# EAGLE design LCD and Keypad Arduino Uno Shield_V2 (EAGLE 9.6.2)
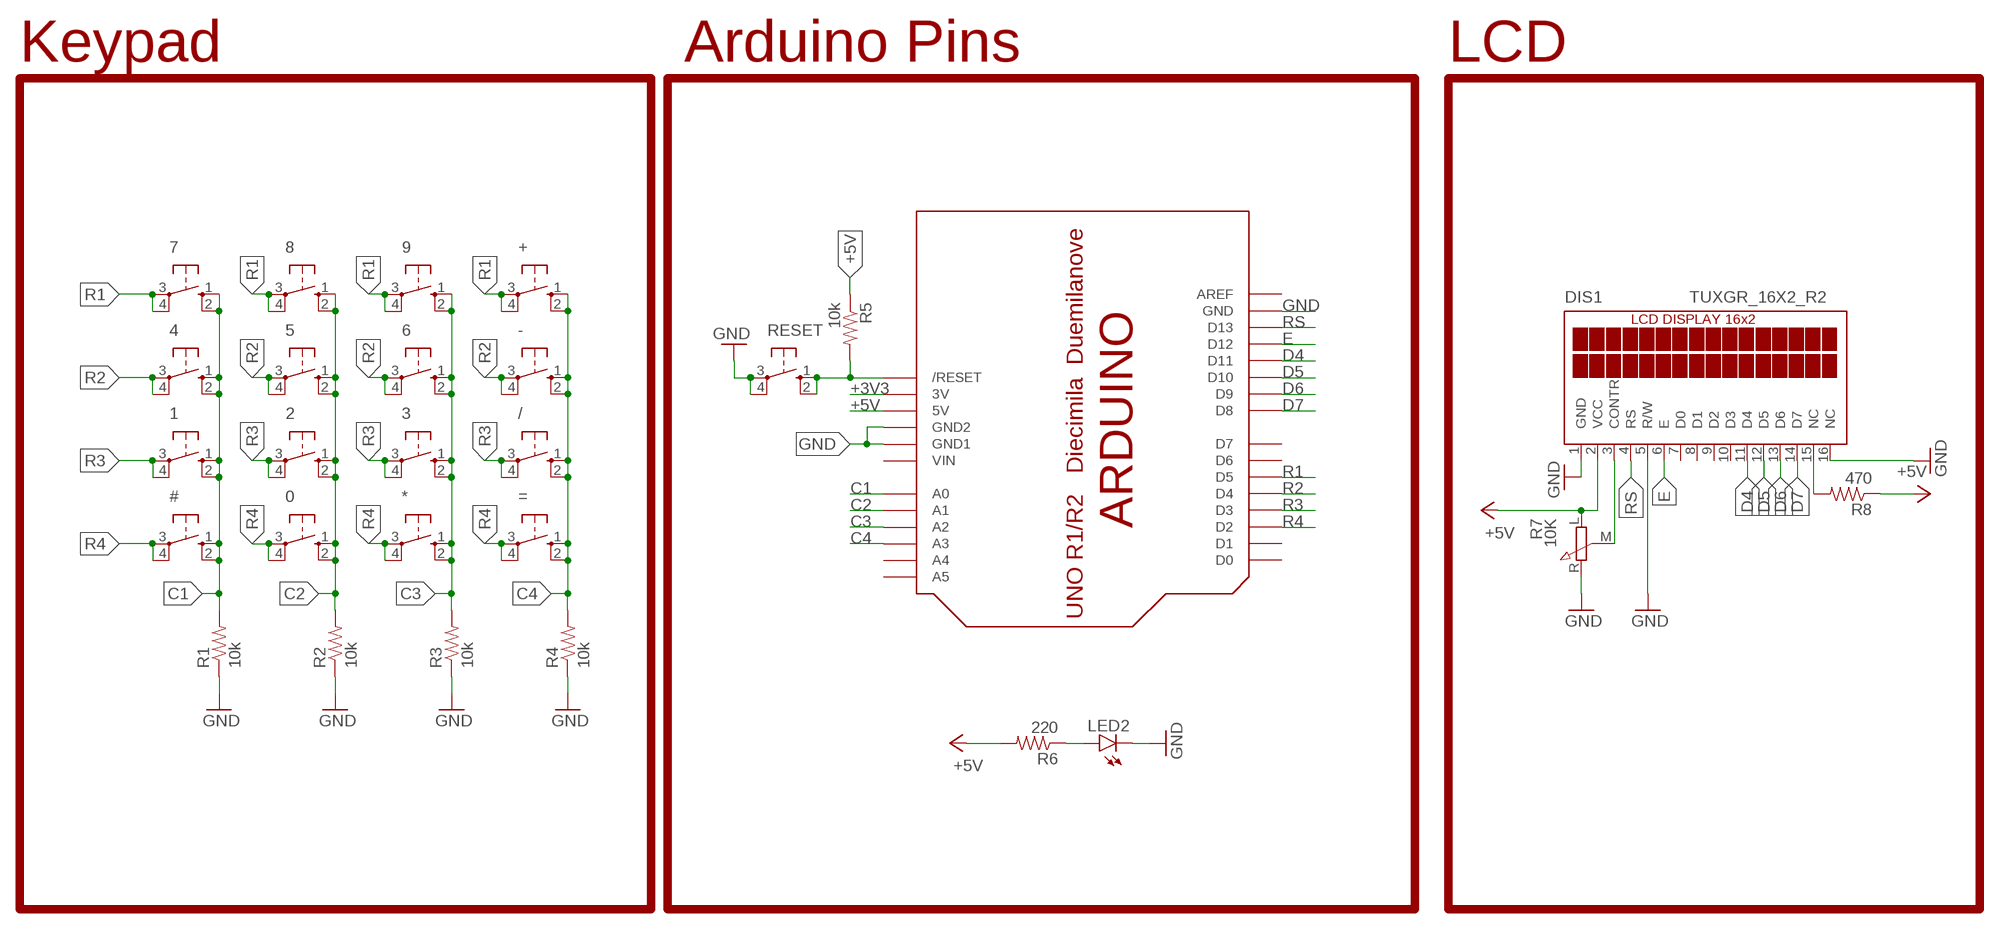
[diagram p0: schematic, sheet 1]

## Parts
0  10-XX  [B3F-10XX]
1  10-XX  [B3F-10XX]
2  10-XX  [B3F-10XX]
3  10-XX  [B3F-10XX]
4  10-XX  [B3F-10XX]
5  10-XX  [B3F-10XX]
6  10-XX  [B3F-10XX]
7  10-XX  [B3F-10XX]
8  10-XX  [B3F-10XX]
9  10-XX  [B3F-10XX]
#  10-XX  [B3F-10XX]
*  10-XX  [B3F-10XX]
+  10-XX  [B3F-10XX]
-  10-XX  [B3F-10XX]
/  10-XX  [B3F-10XX]
=  10-XX  [B3F-10XX]
DIS1  TUXGR_16X2_R2  [TUXGR_16X2_R2]
LED2  LEDSML0805  [SML0805]
R1  10k  RESISTOR1206  [1206]
R2  10k  RESISTOR1206  [1206]
R3  10k  RESISTOR1206  [1206]
R4  10k  RESISTOR1206  [1206]
R5  10k  RESISTOR1206  [1206]
R6  220  RESISTOR1206  [1206]
R7  10K  POT-EU  [RM-065]
R8  470  RESISTOR1206  [1206]
RESET  10-XX  [B3F-10XX]
U$1  ARDUINO-NODIM  [ARDUINO-NODIM]

## Nets
+3V3: U$1.3V
+5V: DIS1.2(VCC) R5.1 R6.2 R7.L R8.1 U$1.5V
C1: 1.1(S) 1.2(S1) 4.1(S) 4.2(S1) 7.1(S) 7.2(S1) #.1(S) #.2(S1) R1.2 U$1.A0
C2: 0.1(S) 0.2(S1) 2.1(S) 2.2(S1) 5.1(S) 5.2(S1) 8.1(S) 8.2(S1) R2.2 U$1.A1
C3: 3.1(S) 3.2(S1) 6.1(S) 6.2(S1) 9.1(S) 9.2(S1) *.1(S) *.2(S1) R3.2 U$1.A2
C4: +.1(S) +.2(S1) -.1(S) -.2(S1) /.1(S) /.2(S1) =.1(S) =.2(S1) R4.2 U$1.A3
D4: DIS1.11(D4) U$1.D11
D5: DIS1.12(D5) U$1.D10
D6: DIS1.13(D6) U$1.D9
D7: DIS1.14(D7) U$1.D8
E: DIS1.6(E) U$1.D12
GND: DIS1.1(GND) DIS1.5(R/W) DIS1.16(NC) LED2.C R1.1 R2.1 R3.1 R4.1 R7.R RESET.3(P) RESET.4(P1) U$1.GND U$1.GND1 U$1.GND2
N$3: DIS1.3(CONTR) R7.M
N$7: DIS1.15(NC) R8.2
N$11: LED2.A R6.1
R1: 7.3(P) 7.4(P1) 8.3(P) 8.4(P1) 9.3(P) 9.4(P1) +.3(P) +.4(P1) U$1.D5
R2: 4.3(P) 4.4(P1) 5.3(P) 5.4(P1) 6.3(P) 6.4(P1) -.3(P) -.4(P1) U$1.D4
R3: 1.3(P) 1.4(P1) 2.3(P) 2.4(P1) 3.3(P) 3.4(P1) /.3(P) /.4(P1) U$1.D3
R4: 0.3(P) 0.4(P1) #.3(P) #.4(P1) *.3(P) *.4(P1) =.3(P) =.4(P1) U$1.D2
RESET: R5.2 RESET.1(S) RESET.2(S1) U$1.RESET(/RESET)
RS: DIS1.4(RS) U$1.D13
Unconnected: DIS1.7(D0) DIS1.8(D1) DIS1.9(D2) DIS1.10(D3) U$1.A4 U$1.A5 U$1.AREF U$1.D0 U$1.D1 U$1.D6 U$1.D7

## Notes on the sheet
- Keypad | Arduino Pins | LCD

## Power pins joined to a net without a drawn wire
VIN: U$1.VIN

## Library data of the parts
0 1-9 # * + - / = RESET = switch-omron:10-XX: OMRON SWITCH; MPN: B3F-1000; OC_FARNELL: 176432; OC_NEWARK: 36M3542
DIS1 = display-lcd:TUXGR_16X2_R2: Tuxgraphics LCD display 16x2 characters reflective, without background light Source: tuxgr_12x2_r2.pdf; OC_FARNELL: unknown; OC_NEWARK: unknown
LED2 = led:LED: LED OSRAM: - CHIPLED LG R971, LG N971, LY N971, LG Q971, LY Q971, LO R971, LY R971 LH N974, LH R974 LS Q976, LO Q976, LY Q976 LO Q996 - Hyper CHIPLED LW Q18S LB Q993, LB Q99A, LB R99A - SideLED LS A670, LO A670, LY A670, LG A670, LP A670 LB A673, LV A673, LT A673, LW A673 LH A674 LY A675 LS A676, LA A676, LO A676, LY A676, LW A676 LS A679, LY A679, LG A679 - Hyper Micro SIDELED® LS Y876, LA Y876, LO Y876, LY Y876 LT Y87S - SmartLED LW L88C, LW L88S LB L89C, LB L89S, LG L890 LS L89K, LO L89K, LY L89K LS L896, LA L896, LO L896, LY L896 - TOPLED LS T670, LO T670, LY T670, LG T670, LP T670 LSG T670, LSP T670, LSY T670, LOP T670, LYG T670 LG T671, LOG T671, LSG T671 LB T673, LV T673, LT T673, LW T673 LH T674 LS T676, LA T676, LO T676, LY T676, LB T676, LH T676, LSB T676, LW T676 LB T67C, LV T67C, LT T67C, LS T67K, LO T67K, LY T67K, LW E67C LS E67B, LA E67B, LO E67B, LY E67B, LB E67C, LV E67C, LT E67C LW T67C LS T679, LY T679, LG T679 LS T770, LO T770, LY T770, LG T770, LP T770 LB T773, LV T773, LT T773, LW T773 LH T774 LS E675, LA E675, LY E675, LS T675 LS T776, LA T776, LO T776, LY T776, LB T776 LHGB T686 LT T68C, LB T68C - Hyper Mini TOPLED® LB M676 - Mini TOPLED Santana® LG M470 LS M47K, LO M47K, LY M47K Source: http://www.osram.convergy.de LUXEON: - LUMILED® LXK2-PW12-R00, LXK2-PW12-S00, LXK2-PW14-U00, LXK2-PW14-V00 LXK2-PM12-R00, LXK2-PM12-S00, LXK2-PM14-U00 LXK2-PE12-Q00, LXK2-PE12-R00, LXK2-PE12-S00, LXK2-PE14-T00, LXK2-PE14-U00 LXK2-PB12-K00, LXK2-PB12-L00, LXK2-PB12-M00, LXK2-PB14-N00, LXK2-PB14-P00, LXK2-PB14-Q00 LXK2-PR12-L00, LXK2-PR12-M00, LXK2-PR14-Q00, LXK2-PR14-R00 LXK2-PD12-Q00, LXK2-PD12-R00, LXK2-PD12-S00 LXK2-PH12-R00, LXK2-PH12-S00 LXK2-PL12-P00, LXK2-PL12-Q00, LXK2-PL12-R00 Source: www.luxeon.com KINGBRIGHT: KA-3528ASYC Source: www.kingbright.com
R1-R6 R8 = SparkFun-Resistors:RESISTOR: Generic Resistor Package
R7 = Potentiometer:POT-EU
U$1 = adafruit:ARDUINO: Arduino Diecimila/Duemilanove Make a shield with ease, this package has all the named pins as well as the two mounting drill holes and an outline of the USB and DC power connector. The outline is on the DIMENSION layer, so if your board house uses it they will cut the outline to match. http://www.ladyada.net/library/pcb/eaglelibrary.html

## Board
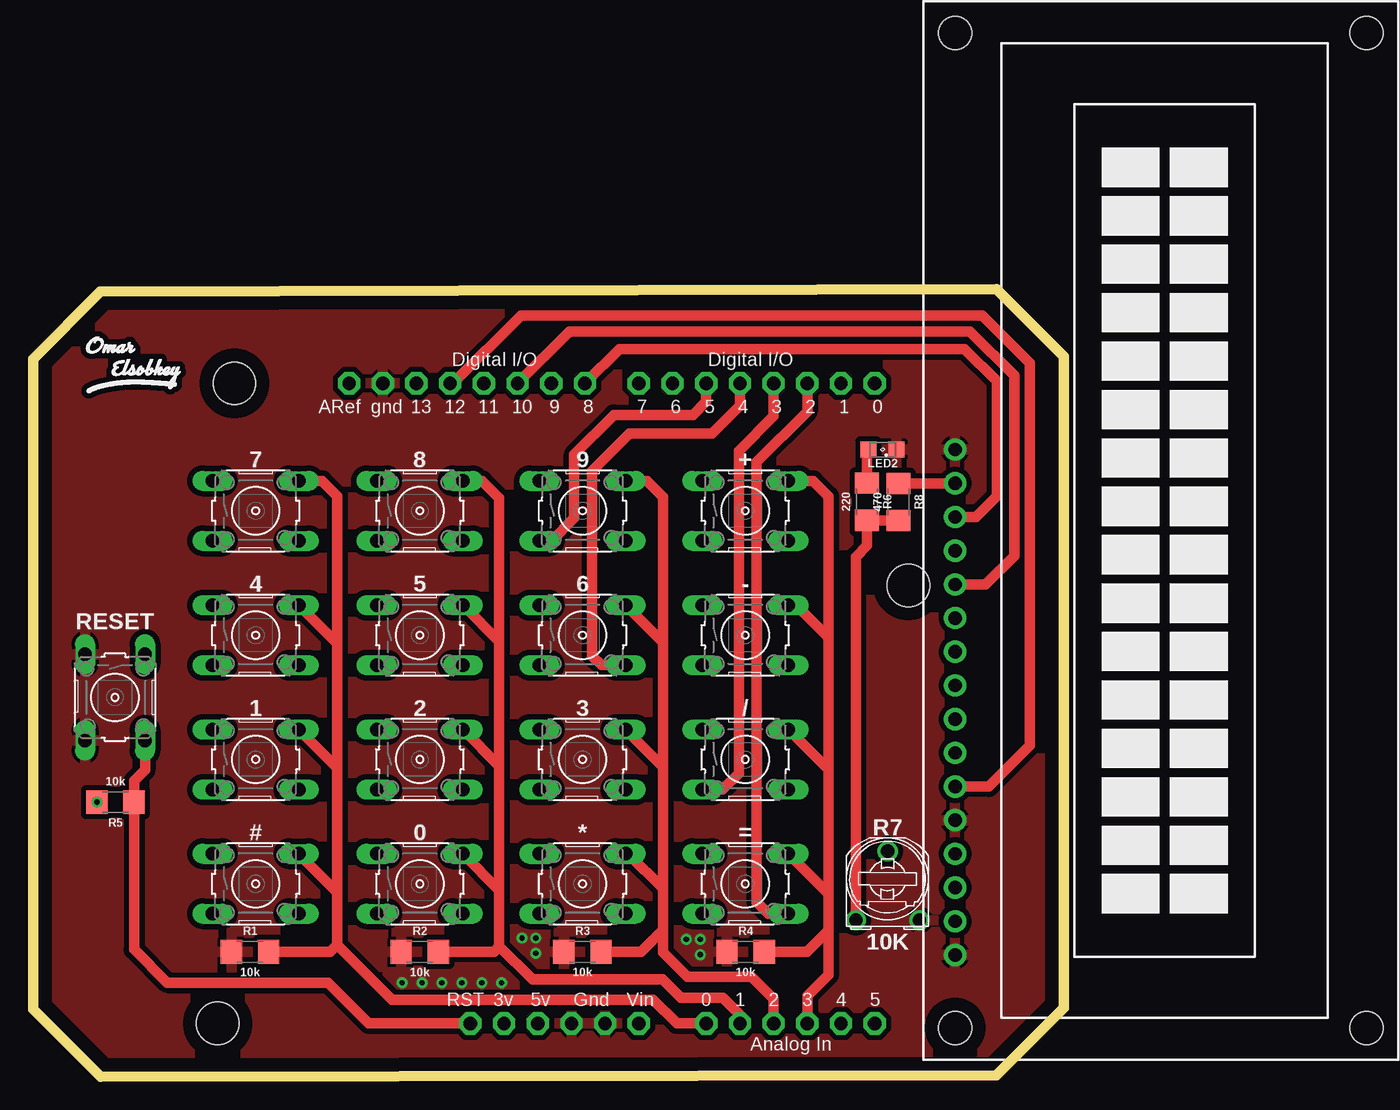
[diagram p1: board, top side]
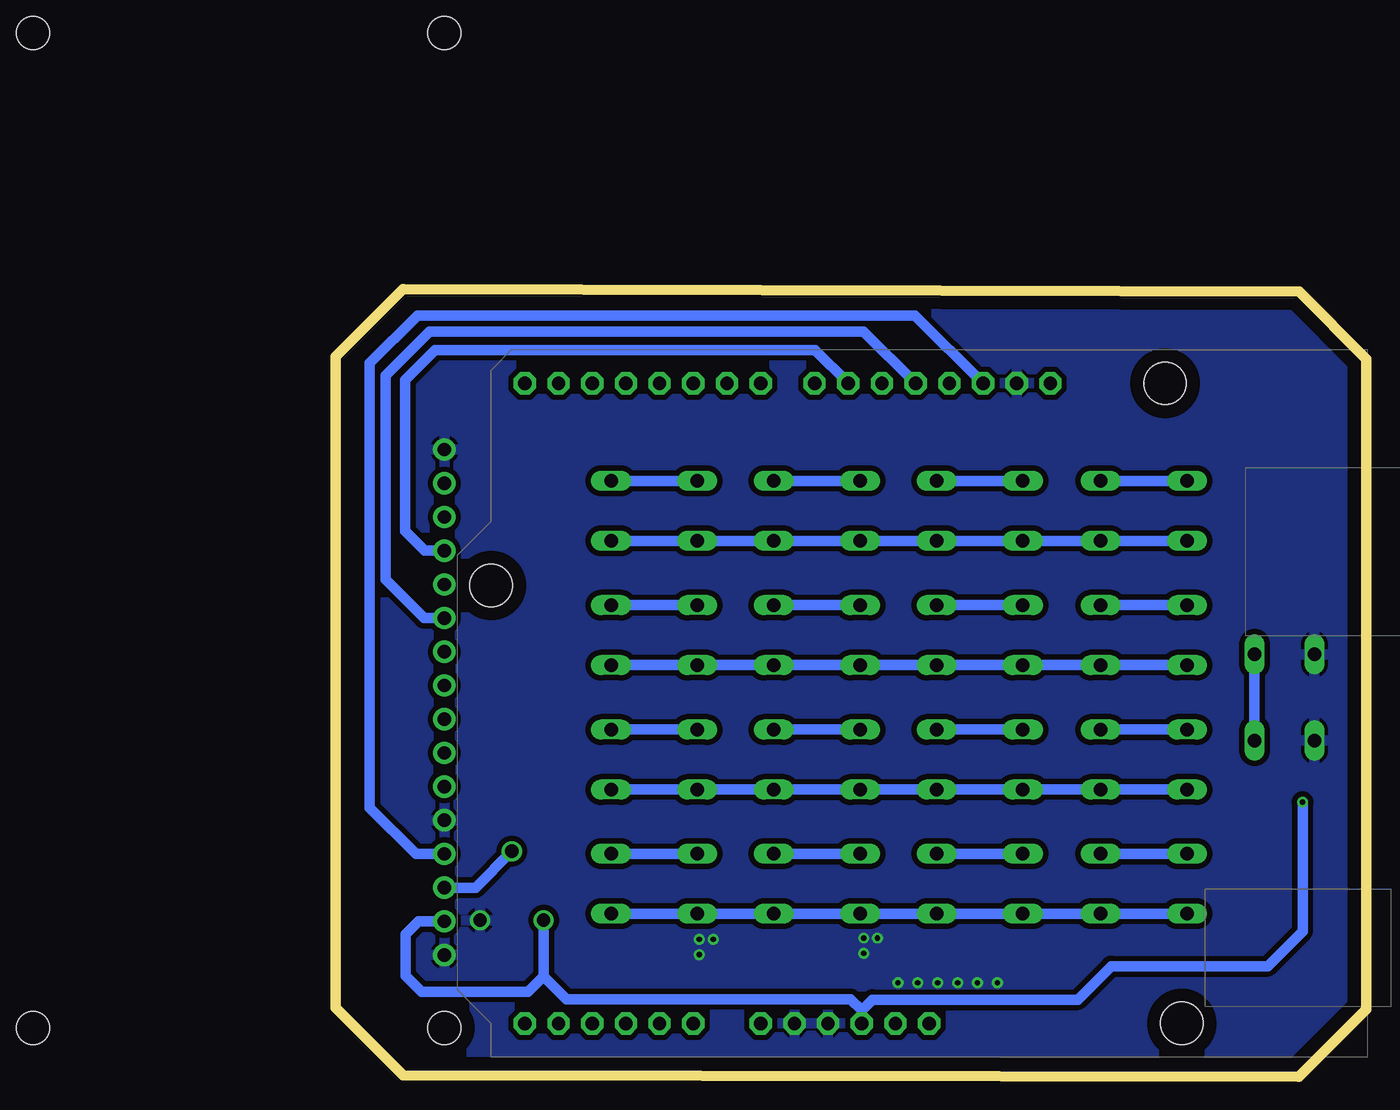
[diagram p2: board, bottom side, seen from below]

Size 77.7 x 59.37 mm. Coordinates in mm from the lower left corner, seen from the top.
Outline: 72.6,59.37 5.06,59.18 0,54.1 0,5.08 5.09,0 72.63,0.09 77.7,5.17 77.7,54.29 72.6,59.37
Copper layers (1*16): Top 0.035mm / dielectric 1.5mm / Bottom 0.035mm
Design rules "default *": minimum track width 0.6mm, minimum drill 0.4mm, track to track 0.4mm, track to pad 0.4mm, pad to pad 0.4mm, via to via 0.4mm, smd to smd 0.4mm, copper to edge 40mil, drill to drill 6mil, minimum pad ring 10mil, minimum via ring 8mil, stop-mask expansion 4mil, vias tented up to drill 0mil, thermal gap 10mil
Holes 3.2 mm at 15.18,52.27 65.98,37.03 13.91,4.01
Holes 2.5 mm at 100.5,3.67 100.5,78.67 69.5,3.67 69.5,78.67

### Footprints (pad centres in the part's own frame; a part is rotated, then mirrored left to right if it is on the bottom)
B3F-10XX = drill 1.016 long: 1 -3.251,2.261; 2 3.251,2.261; 3 -3.251,-2.261; 4 3.251,-2.261
TUXGR_16X2_R2 = drill 1 pad 1.676: 1 -32,15.5; 2 -29.46,15.5; 3 -26.92,15.5; 4 -24.38,15.5; 5 -21.84,15.5; 6 -19.3,15.5; 7 -16.76,15.5; 8 -14.22,15.5; 9 -11.68,15.5; 10 -9.14,15.5; 11 -6.6,15.5; 12 -4.06,15.5; 13 -1.52,15.5; 14 1.02,15.5; 15 3.56,15.5; 16 6.1,15.5 | hole 2.5: -37.5,-15.5; 37.5,-15.5; -37.5,15.5; 37.5,15.5
SML0805 = smd 1.2 x 1.2: A 1.05,0; C -1.05,0
1206 = smd 1.6 x 1.8: 1 -1.4,0; 2 1.4,0
RM-065 = drill 1: L -2.373,-1.865; M 0.027,3.335; R 2.427,-1.865
ARDUINO-NODIM = drill 1 pad 1.676 octagon: 3V 35.56,2.54; 5V 38.1,2.54; A0 50.8,2.54; A1 53.34,2.54; A2 55.88,2.54; A3 58.42,2.54; A4 60.96,2.54; A5 63.5,2.54; AREF 23.876,50.8; D0 63.5,50.8; D1 60.96,50.8; D2 58.42,50.8; D3 55.88,50.8; D4 53.34,50.8; D5 50.8,50.8; D6 48.26,50.8; D7 45.72,50.8; D8 41.656,50.8; D9 39.116,50.8; D10 36.576,50.8; D11 34.036,50.8; D12 31.496,50.8; D13 28.956,50.8; GND 26.416,50.8; GND1 43.18,2.54; GND2 40.64,2.54; RESET 33.02,2.54; VIN 45.72,2.54 | hole 3.2: 15.24,50.8; 66.04,35.56; 13.97,2.54

### Placement (x,y rotation side)
0  29.15,14.53 0 top
1  16.77,23.91 0 top
2  29.15,23.91 0 top
3  41.42,23.91 0 top
4  16.77,33.28 0 top
5  29.15,33.28 0 top
6  41.42,33.28 0 top
7  16.77,42.65 0 top
8  29.15,42.65 0 top
9  41.42,42.65 0 top
#  16.77,14.53 0 top
*  41.42,14.53 0 top
+  53.68,42.65 0 top
-  53.68,33.28 0 top
/  53.68,23.91 0 top
=  53.68,14.53 0 top
DIS1  85,41.17 90 top
LED2  64.03,47.27 180 top
R1  16.35,9.42 0 top
R2  29.15,9.42 0 top
R3  41.41,9.42 0 top
R4  53.71,9.42 0 top
R5  6.21,20.69 0 top
R6  62.85,43.35 270 top
R7  64.39,13.66 0 top
R8  65.22,43.32 90 top
RESET  6.17,28.59 270 top
U$1  -0.06,1.47 0 top
U$2  [OMAR_ELSOBKEY_X0.5]  7.21,53.47 0 top

### Tracks (layer width: path | path; a pad name or v marks a point on that pad's centre or on a via)
+5V  (via drill 0.4)
  Top 0.8: R8.1 62.87,41.92 | 62.87,41.92 R6.2 | R7.L 62.02,39.19 62.87,40.04 62.87,41.92
  Bottom 0.8: U$1.5V 38.04,4.99 | R7.L 62.02,7.55 | 38.04,4.99 38.88,5.83 60.3,5.83 62.02,7.55 | 62.02,7.55 63.18,6.38 71.22,6.38 72.43,7.59 72.43,10.72 71.44,11.71 DIS1.2 | 38.04,4.99 37.23,5.8 21.75,5.8 19.23,8.32 7.44,8.32 4.81,10.96 R5.1
  other vias: 4.81,20.69
C1
  Top 0.8: 7.2 21.79,44.91 22.91,43.79 22.91,32.65 | 22.91,32.65 22.91,23.28 | 22.91,23.28 22.91,13.91 | 22.91,13.91 22.91,9.93 | 22.91,9.93 27.04,5.8 46.73,5.8 48.52,4.01 U$1.A0 | 4.2 22.91,32.65 | 1.2 22.91,23.28 | #.2 22.91,13.91 | 22.91,9.93 22.41,9.42 R1.2
  Bottom 0.8: 7.1 7.2 | 4.1 4.2 | #.2 #.1 | 1.2 1.1
C2
  Top 0.8: 8.2 33.84,44.91 35.14,43.62 35.14,32.8 | 35.14,32.8 35.14,23.43 | 35.14,23.43 35.14,14.05 | 35.14,14.05 35.14,9.82 | U$1.A1 53.28,4.67 52.02,5.93 48.86,5.93 47.45,7.33 37.63,7.33 35.14,9.82 | 0.2 35.14,14.05 | 2.2 35.14,23.43 | 5.2 35.14,32.8 | 35.14,9.82 34.73,9.42 R2.2
  Bottom 0.8: 5.1 5.2 | 8.1 8.2 | 0.2 0.1 | 2.1 2.2
C3
  Top 0.8: 9.2 46.27,44.91 47.47,43.71 47.47,32.73 | U$1.A2 55.82,5.86 54.15,7.53 49.33,7.53 47.47,9.39 47.47,11.07 | 47.47,32.73 47.47,23.36 | 47.47,23.36 47.47,14.18 | 47.47,14.18 47.47,11.07 | 47.47,11.07 45.82,9.42 R3.2 | 44.89,16.79 *.2 44.86,16.79 47.47,14.18 | 6.2 47.47,32.73 | 3.2 47.47,23.36
  Bottom 0.8: 9.1 9.2 | *.2 *.1 | 6.2 6.1 | 3.1 3.2
C4
  Top 0.8: +.2 58.79,44.91 59.96,43.74 59.96,33.1 | 59.96,33.1 59.96,23.14 | 59.96,23.14 59.96,13.77 | 59.96,13.77 59.96,11.03 | R4.2 58.34,9.42 59.96,11.03 | 59.96,11.03 59.96,7.69 58.36,6.09 U$1.A3 | -.2 57.52,35.54 59.96,33.1 | /.2 59.96,23.14 | =.2 59.96,13.77
  Bottom 0.8: +.1 +.2 | -.2 -.1 | /.2 /.1 | =.2 =.1
D4
  Bottom 0.8: U$1.D11 37.89,56.19 70.6,56.19 73.93,52.86 73.93,37.46 71.04,34.57 DIS1.11
D5
  Top 0.8: U$1.D10 40.43,56.18 70.62,56.18 73.95,52.85 73.95,39.26 71.8,37.11 DIS1.12
D6
  Bottom 0.8: U$1.D9 41.57,54.78 70.22,54.78 72.48,52.52 72.48,41.12 71.01,39.65 DIS1.13
D7
  Top 0.8: U$1.D8 44.19,54.86 70.2,54.86 72.63,52.42 72.63,43.76 71.06,42.19 DIS1.14
E
  Top 0.8: U$1.D12 31.66,52.27 36.77,57.38 71.57,57.38 75.15,53.79 75.15,24.99 72.04,21.87 DIS1.6
GND  (via drill 0.4)
  other vias: 27.82,7.08 29.32,7.08 30.82,7.08 32.32,7.08 33.82,7.08 35.32,7.08 37.9,10.45 36.85,10.45 37.9,9.3 50.28,10.34 49.24,10.34 50.29,9.19
  pour Top (isolate 0.4): -2.6,61.37 81.3,61.37 81.3,-1.73 -2.6,-1.73
  pour Bottom (isolate 0.4): -4.4,62.67 82.7,62.67 82.7,-3.03 -4.4,-3.03
N$3
  Bottom 0.8: R7.M 67.17,14.25 DIS1.3
N$7
  Top 0.8: R8.2 69.5,44.72 DIS1.15
N$11
  Top 0.8: R6.1 62.85,47.13 LED2.A
R1
  Top 0.8: 9.3 39.08,40.39 40.79,42.1 40.79,46.9 43.78,49.89 49.74,49.89 50.74,50.88 U$1.D5
  Bottom 0.8: 7.3 7.4 8.3 8.4 9.3 9.4 +.3 +.4
R2
  Top 0.8: U$1.D4 53.28,50.58 51.17,48.48 44.96,48.48 42.14,45.66 42.14,31.73 42.85,31.02 6.4
  Bottom 0.8: 4.3 4.4 5.3 5.4 6.3 6.4 -.3 -.4
R3
  Top 0.8: /.3 51.97,21.65 53.19,22.87 53.19,47.18 55.82,49.81 U$1.D3
  Bottom 0.8: 1.3 1.4 2.3 2.4 3.3 3.4 /.3 /.4
R4
  Top 0.8: U$1.D2 58.36,50.15 54.55,46.34 54.55,13.17 55.45,12.26 =.4
  Bottom 0.8: #.3 #.4 0.3 0.4 *.3 *.4 =.3 =.4
RESET
  Top 0.8: RESET.2 8.43,23.11 7.61,22.28 R5.2 7.61,9.59 10.11,7.08 22.23,7.08 25.3,4.01 U$1.RESET
  Bottom 0.8: RESET.1 RESET.2
RS
  Bottom 0.8: U$1.D13 34.01,57.39 71.53,57.39 75.13,53.79 75.13,20.27 71.65,16.79 DIS1.4